# Altium schematic sheet LEDS-managed.SchDoc
size A4
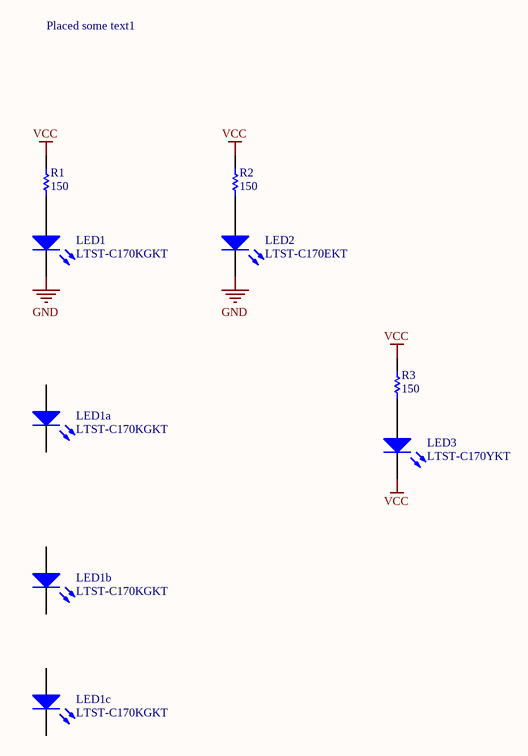
[diagram p0: LEDS-managed.SchDoc]

## Parts
LED1  LTST-C170KGKT  [LED2013 - GREEN]
LED1a  LTST-C170KGKT  [LED2013 - GREEN]
LED1b  LTST-C170KGKT  [LED2013 - GREEN]
LED1c  LTST-C170KGKT  [LED2013 - GREEN]
LED2  LTST-C170EKT  [LED2013 - RED]
LED3  LTST-C170YKT  [LED2013 - YELLOW]
R1  value 150  [RESC60X30X26L15L (0201)]  (hidden comment: ERA-0201-901132)
R2  value 150  [RESC60X30X26L15L (0201)]  (hidden comment: ERA-0201-901132)
R3  value 150  [RESC60X30X26L15L (0201)]  (hidden comment: ERA-0201-901132)

## Nets
GND: LED1.2(K) LED2.2(K)
VCC: LED3.2(K) R1.2 R2.2 R3.2
NetLED1_1: LED1.1(A) R1.1
NetLED2_1: LED2.1(A) R2.1
NetLED3_1: LED3.1(A) R3.1

Not connected (* = marked no-connect by the designer): LED1a 1(A) 2(K); LED1b 1(A) 2(K); LED1c 1(A) 2(K)

## Notes on the sheet
- Placed some text1

## Library data of the parts
LED1 LED1a LED1b LED1c = CMP-007-00052-1: LED, Green 0805 (2013); Purchase Item ID: 135.1001; Category: LED; Design Item Id: LED-GRN-0805
LED2 = CMP-007-00053-1: LED, Red 0805 (2013); Purchase Item ID: 135.1003; Category: LED; Design Item Id: LED-RED-0805
LED3 = CMP-007-00051-1: LED, Yellow 0805 (2013); Purchase Item ID: 135.1002; Design Item Id: LED-YLW-0805; Category: LED
R1-R3 = CMP-009-00404-1: Res, 150R, 0.05W, 1%,  0201 SMD; Manufacturer Part Number 1: ERJ-1GNF1500C; Manufacturer 1: Panasonic-ECG; Power: 50mW; Tolerance: 0.01%; NUV_Level: Level-3; Temp Co: 200ppm/C; SUPPLIER PART NUMBER 2: RMCF0201FT150RDKR-ND; SUPPLIER 3: Digi-Key; Case/Package: 0201 (0603 Metric); SUPPLIER PART NUMBER 3: YAG5158DKR-ND; RoHS: RoHS; Manufacturer Part Number 2: RMCF0201FT150R; SUPPLIER 1: Digi-Key; SUPPLIER 2: Digi-Key; Manufacturer 3: Yageo; Manufacturer 2: Stackpole Electronics Inc; TYPE: Thick Film Chip Resistor; SUPPLIER PART NUMBER 1: P122742DKR-ND; NUV_PART_NO: ERA-0201-901132; NUV_DESCRIPTION: Res, 150R, 0.05W, 1%,  0201 SMD